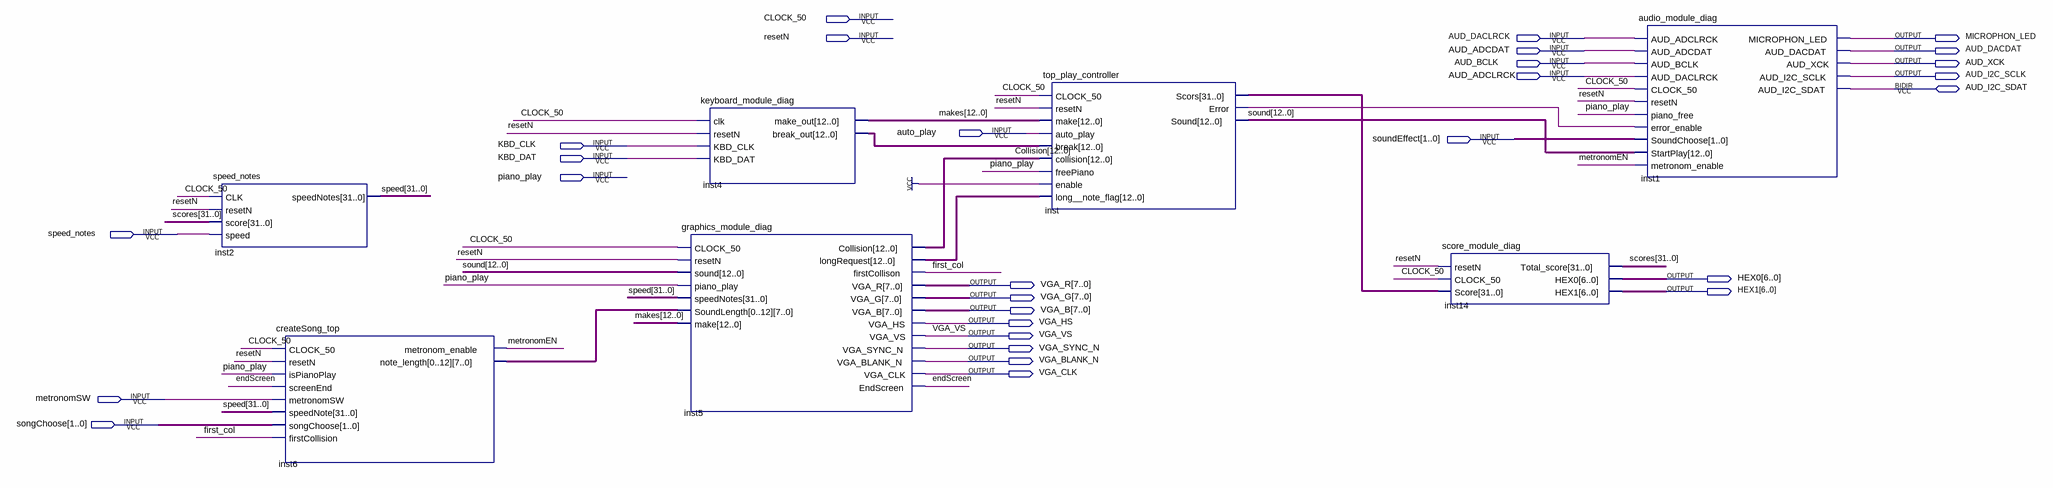
[diagram p0: schematic sheet]
// Quartus schematic TOP_module_diag.bdf as structural Verilog: 7 symbols, 29 pins
module TOP_module_diag (
  input  CLOCK_50,
  input  resetN,
  input  AUD_DACLRCK,
  input  AUD_ADCDAT,
  input  AUD_BCLK,
  input  AUD_ADCLRCK,
  input  auto_play,
  input  [1:0] soundEffect,
  input  KBD_CLK,
  input  KBD_DAT,
  input  piano_play,
  input  speed_notes,
  input  metronomSW,
  input  [1:0] songChoose,
  inout  AUD_I2C_SDAT,
  output MICROPHON_LED,
  output AUD_DACDAT,
  output AUD_XCK,
  output AUD_I2C_SCLK,
  output [6:0] HEX0,
  output [7:0] VGA_R,
  output [6:0] HEX1,
  output [7:0] VGA_G,
  output [7:0] VGA_B,
  output VGA_HS,
  output VGA_VS,
  output VGA_SYNC_N,
  output VGA_BLANK_N,
  output VGA_CLK
);

  wire endScreen, first_col, inst_error, metronomEN;
  wire [12:0] Collision, inst4_break_out, inst5_longrequest, makes, sound;
  wire [31:0] inst_scors, scores, speed;
  wire [103:0] inst6_note_length;

  speed_notes inst2 (.CLK(CLOCK_50), .resetN(resetN), .score(scores), .speed(speed_notes), .speedNotes(speed));
  createSong_top inst6 (
    .CLOCK_50(CLOCK_50), .resetN(resetN), .isPianoPlay(piano_play), .screenEnd(endScreen),
    .metronomSW(metronomSW), .speedNote(speed), .songChoose(songChoose), .firstCollision(first_col),
    .metronom_enable(metronomEN), .note_length(inst6_note_length));
  graphics_module_diag inst5 (
    .CLOCK_50(CLOCK_50), .resetN(resetN), .sound(sound), .piano_play(piano_play), .speedNotes(speed),
    .SoundLength(inst6_note_length), .make(makes), .Collision(Collision), .longRequest(inst5_longrequest),
    .firstCollison(first_col), .VGA_R(VGA_R), .VGA_G(VGA_G), .VGA_B(VGA_B), .VGA_HS(VGA_HS), .VGA_VS(VGA_VS),
    .VGA_SYNC_N(VGA_SYNC_N), .VGA_BLANK_N(VGA_BLANK_N), .VGA_CLK(VGA_CLK), .EndScreen(endScreen));
  keyboard_module_diag inst4 (
    .clk(CLOCK_50), .resetN(resetN), .KBD_CLK(KBD_CLK), .KBD_DAT(KBD_DAT), .make_out(makes),
    .break_out(inst4_break_out));
  top_play_controller inst (
    .CLOCK_50(CLOCK_50), .resetN(resetN), .make(makes), .auto_play(auto_play), .\break (inst4_break_out),
    .collision(Collision), .freePiano(piano_play), .enable(1'b1), .long__note_flag(inst5_longrequest),
    .Scors(inst_scors), .Error(inst_error), .Sound(sound));
  score_module_diag inst14 (
    .resetN(resetN), .CLOCK_50(CLOCK_50), .Score(inst_scors), .Total_score(scores), .HEX0(HEX0), .HEX1(HEX1));
  audio_module_diag inst1 (
    .AUD_ADCLRCK(AUD_DACLRCK), .AUD_ADCDAT(AUD_ADCDAT), .AUD_BCLK(AUD_BCLK), .AUD_DACLRCK(AUD_ADCLRCK),
    .CLOCK_50(CLOCK_50), .resetN(resetN), .piano_free(piano_play), .error_enable(inst_error),
    .SoundChoose(soundEffect), .StartPlay(sound), .metronom_enable(metronomEN),
    .MICROPHON_LED(MICROPHON_LED), .AUD_DACDAT(AUD_DACDAT), .AUD_XCK(AUD_XCK), .AUD_I2C_SCLK(AUD_I2C_SCLK),
    .AUD_I2C_SDAT(AUD_I2C_SDAT));
endmodule
